# Altium schematic sheet VoltageHeaders.SchDoc
size 381 x 317 mm
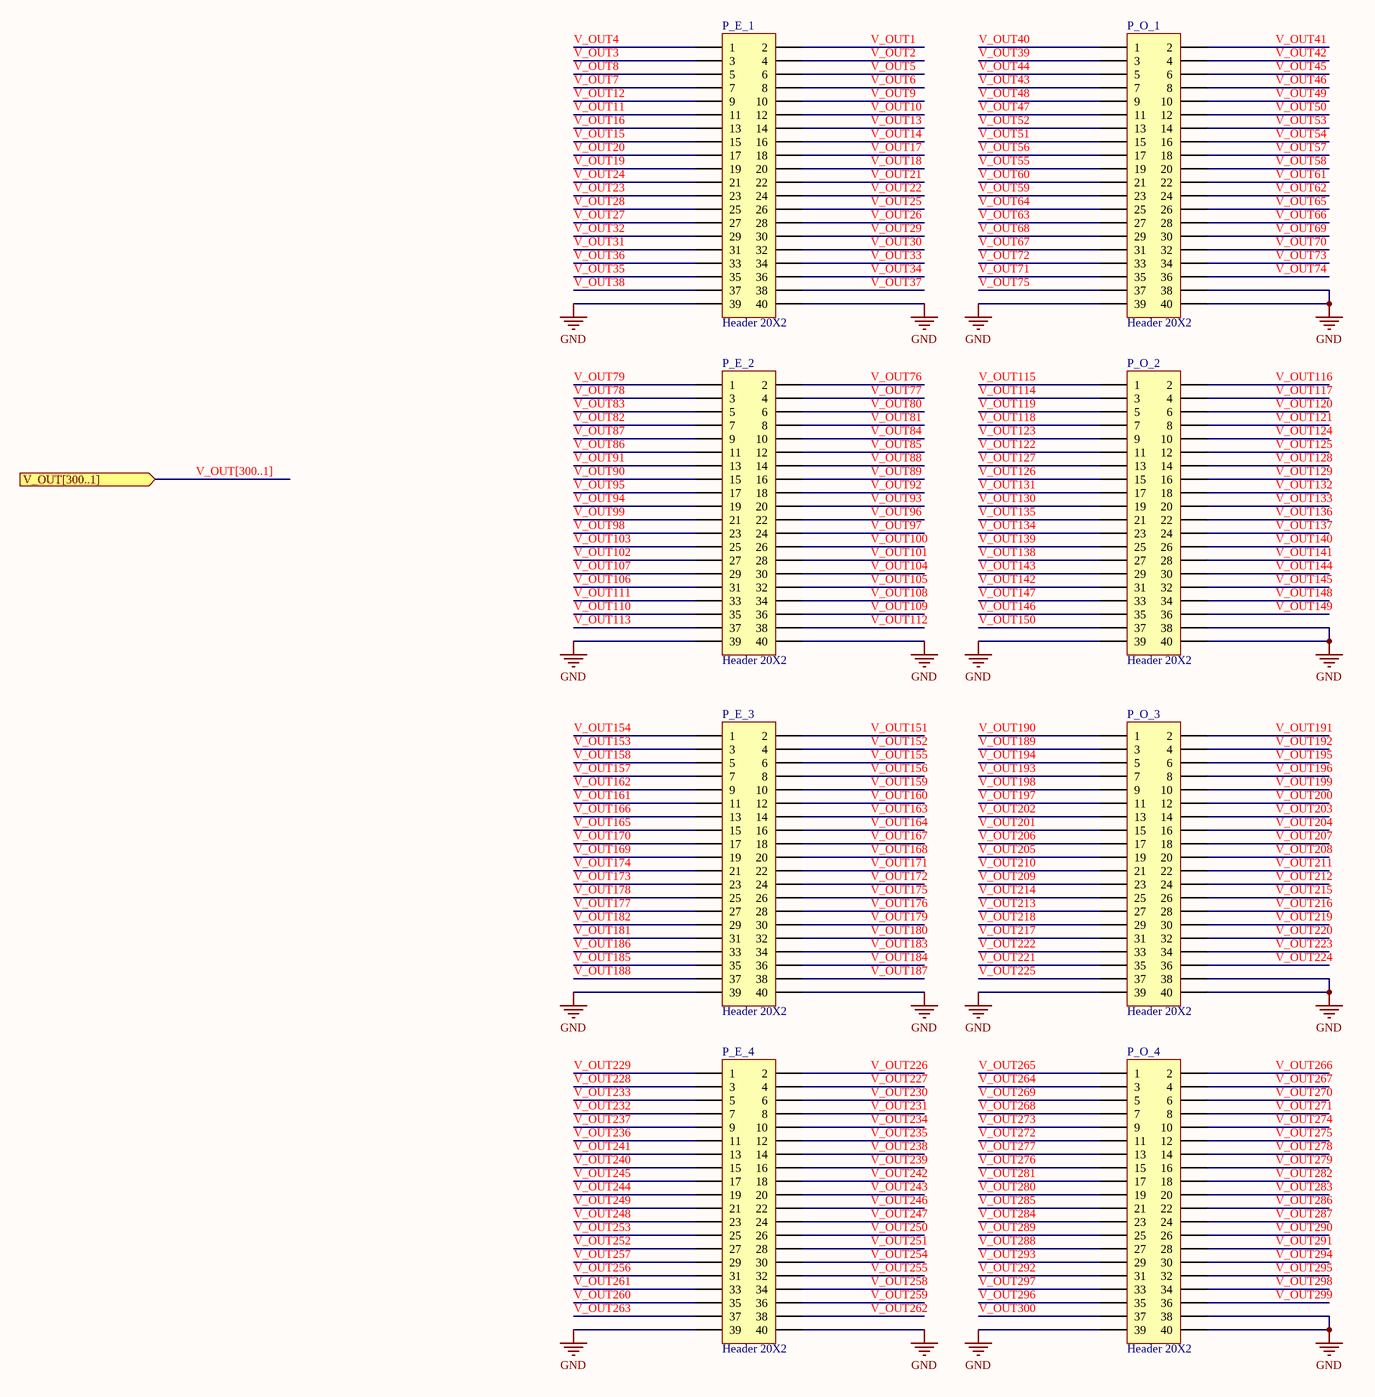
[diagram p0: VoltageHeaders.SchDoc]

## Parts
P_E_1  Header 20X2  [HDR2X20]
P_E_2  Header 20X2  [HDR2X20]
P_E_3  Header 20X2  [HDR2X20]
P_E_4  Header 20X2  [HDR2X20]
P_O_1  Header 20X2  [HDR2X20]
P_O_2  Header 20X2  [HDR2X20]
P_O_3  Header 20X2  [HDR2X20]
P_O_4  Header 20X2  [HDR2X20]

## Ports
V_OUT[300..1] (in)

## Nets
GND: P_E_1.39 P_E_1.40 P_E_2.39 P_E_2.40 P_E_3.39 P_E_3.40 P_E_4.39 P_E_4.40 P_O_1.38 P_O_1.39 P_O_1.40 P_O_2.38 P_O_2.39 P_O_2.40 P_O_3.38 P_O_3.39 P_O_3.40 P_O_4.38 P_O_4.39 P_O_4.40
V_OUT1: P_E_1.2
V_OUT2: P_E_1.4
V_OUT3: P_E_1.3
V_OUT4: P_E_1.1
V_OUT5: P_E_1.6
V_OUT6: P_E_1.8
V_OUT7: P_E_1.7
V_OUT8: P_E_1.5
V_OUT9: P_E_1.10
V_OUT10: P_E_1.12
V_OUT11: P_E_1.11
V_OUT12: P_E_1.9
V_OUT13: P_E_1.14
V_OUT14: P_E_1.16
V_OUT15: P_E_1.15
V_OUT16: P_E_1.13
V_OUT17: P_E_1.18
V_OUT18: P_E_1.20
V_OUT19: P_E_1.19
V_OUT20: P_E_1.17
V_OUT21: P_E_1.22
V_OUT22: P_E_1.24
V_OUT23: P_E_1.23
V_OUT24: P_E_1.21
V_OUT25: P_E_1.26
V_OUT26: P_E_1.28
V_OUT27: P_E_1.27
V_OUT28: P_E_1.25
V_OUT29: P_E_1.30
V_OUT30: P_E_1.32
V_OUT31: P_E_1.31
V_OUT32: P_E_1.29
V_OUT33: P_E_1.34
V_OUT34: P_E_1.36
V_OUT35: P_E_1.35
V_OUT36: P_E_1.33
V_OUT37: P_E_1.38
V_OUT38: P_E_1.37
V_OUT39: P_O_1.3
V_OUT40: P_O_1.1
V_OUT41: P_O_1.2
V_OUT42: P_O_1.4
V_OUT43: P_O_1.7
V_OUT44: P_O_1.5
V_OUT45: P_O_1.6
V_OUT46: P_O_1.8
V_OUT47: P_O_1.11
V_OUT48: P_O_1.9
V_OUT49: P_O_1.10
V_OUT50: P_O_1.12
V_OUT51: P_O_1.15
V_OUT52: P_O_1.13
V_OUT53: P_O_1.14
V_OUT54: P_O_1.16
V_OUT55: P_O_1.19
V_OUT56: P_O_1.17
V_OUT57: P_O_1.18
V_OUT58: P_O_1.20
V_OUT59: P_O_1.23
V_OUT60: P_O_1.21
V_OUT61: P_O_1.22
V_OUT62: P_O_1.24
V_OUT63: P_O_1.27
V_OUT64: P_O_1.25
V_OUT65: P_O_1.26
V_OUT66: P_O_1.28
V_OUT67: P_O_1.31
V_OUT68: P_O_1.29
V_OUT69: P_O_1.30
V_OUT70: P_O_1.32
V_OUT71: P_O_1.35
V_OUT72: P_O_1.33
V_OUT73: P_O_1.34
V_OUT74: P_O_1.36
V_OUT75: P_O_1.37
V_OUT76: P_E_2.2
V_OUT77: P_E_2.4
V_OUT78: P_E_2.3
V_OUT79: P_E_2.1
V_OUT80: P_E_2.6
V_OUT81: P_E_2.8
V_OUT82: P_E_2.7
V_OUT83: P_E_2.5
V_OUT84: P_E_2.10
V_OUT85: P_E_2.12
V_OUT86: P_E_2.11
V_OUT87: P_E_2.9
V_OUT88: P_E_2.14
V_OUT89: P_E_2.16
V_OUT90: P_E_2.15
V_OUT91: P_E_2.13
V_OUT92: P_E_2.18
V_OUT93: P_E_2.20
V_OUT94: P_E_2.19
V_OUT95: P_E_2.17
V_OUT96: P_E_2.22
V_OUT97: P_E_2.24
V_OUT98: P_E_2.23
V_OUT99: P_E_2.21
V_OUT100: P_E_2.26
V_OUT101: P_E_2.28
V_OUT102: P_E_2.27
V_OUT103: P_E_2.25
V_OUT104: P_E_2.30
V_OUT105: P_E_2.32
V_OUT106: P_E_2.31
V_OUT107: P_E_2.29
V_OUT108: P_E_2.34
V_OUT109: P_E_2.36
V_OUT110: P_E_2.35
V_OUT111: P_E_2.33
V_OUT112: P_E_2.38
V_OUT113: P_E_2.37
V_OUT114: P_O_2.3
V_OUT115: P_O_2.1
V_OUT116: P_O_2.2
V_OUT117: P_O_2.4
V_OUT118: P_O_2.7
V_OUT119: P_O_2.5
V_OUT120: P_O_2.6
V_OUT121: P_O_2.8
V_OUT122: P_O_2.11
V_OUT123: P_O_2.9
V_OUT124: P_O_2.10
V_OUT125: P_O_2.12
V_OUT126: P_O_2.15
V_OUT127: P_O_2.13
V_OUT128: P_O_2.14
V_OUT129: P_O_2.16
V_OUT130: P_O_2.19
V_OUT131: P_O_2.17
V_OUT132: P_O_2.18
V_OUT133: P_O_2.20
V_OUT134: P_O_2.23
V_OUT135: P_O_2.21
V_OUT136: P_O_2.22
V_OUT137: P_O_2.24
V_OUT138: P_O_2.27
V_OUT139: P_O_2.25
V_OUT140: P_O_2.26
V_OUT141: P_O_2.28
V_OUT142: P_O_2.31
V_OUT143: P_O_2.29
V_OUT144: P_O_2.30
V_OUT145: P_O_2.32
V_OUT146: P_O_2.35
V_OUT147: P_O_2.33
V_OUT148: P_O_2.34
V_OUT149: P_O_2.36
V_OUT150: P_O_2.37
V_OUT151: P_E_3.2
V_OUT152: P_E_3.4
V_OUT153: P_E_3.3
V_OUT154: P_E_3.1
V_OUT155: P_E_3.6
V_OUT156: P_E_3.8
V_OUT157: P_E_3.7
V_OUT158: P_E_3.5
V_OUT159: P_E_3.10
V_OUT160: P_E_3.12
V_OUT161: P_E_3.11
V_OUT162: P_E_3.9
V_OUT163: P_E_3.14
V_OUT164: P_E_3.16
V_OUT165: P_E_3.15
V_OUT166: P_E_3.13
V_OUT167: P_E_3.18
V_OUT168: P_E_3.20
V_OUT169: P_E_3.19
V_OUT170: P_E_3.17
V_OUT171: P_E_3.22
V_OUT172: P_E_3.24
V_OUT173: P_E_3.23
V_OUT174: P_E_3.21
V_OUT175: P_E_3.26
V_OUT176: P_E_3.28
V_OUT177: P_E_3.27
V_OUT178: P_E_3.25
V_OUT179: P_E_3.30
V_OUT180: P_E_3.32
V_OUT181: P_E_3.31
V_OUT182: P_E_3.29
V_OUT183: P_E_3.34
V_OUT184: P_E_3.36
V_OUT185: P_E_3.35
V_OUT186: P_E_3.33
V_OUT187: P_E_3.38
V_OUT188: P_E_3.37
V_OUT189: P_O_3.3
V_OUT190: P_O_3.1
V_OUT191: P_O_3.2
V_OUT192: P_O_3.4
V_OUT193: P_O_3.7
V_OUT194: P_O_3.5
V_OUT195: P_O_3.6
V_OUT196: P_O_3.8
V_OUT197: P_O_3.11
V_OUT198: P_O_3.9
V_OUT199: P_O_3.10
V_OUT200: P_O_3.12
V_OUT201: P_O_3.15
V_OUT202: P_O_3.13
V_OUT203: P_O_3.14
V_OUT204: P_O_3.16
V_OUT205: P_O_3.19
V_OUT206: P_O_3.17
V_OUT207: P_O_3.18
V_OUT208: P_O_3.20
V_OUT209: P_O_3.23
V_OUT210: P_O_3.21
V_OUT211: P_O_3.22
V_OUT212: P_O_3.24
V_OUT213: P_O_3.27
V_OUT214: P_O_3.25
V_OUT215: P_O_3.26
V_OUT216: P_O_3.28
V_OUT217: P_O_3.31
V_OUT218: P_O_3.29
V_OUT219: P_O_3.30
V_OUT220: P_O_3.32
V_OUT221: P_O_3.35
V_OUT222: P_O_3.33
V_OUT223: P_O_3.34
V_OUT224: P_O_3.36
V_OUT225: P_O_3.37
V_OUT226: P_E_4.2
V_OUT227: P_E_4.4
V_OUT228: P_E_4.3
V_OUT229: P_E_4.1
V_OUT230: P_E_4.6
V_OUT231: P_E_4.8
V_OUT232: P_E_4.7
V_OUT233: P_E_4.5
V_OUT234: P_E_4.10
V_OUT235: P_E_4.12
V_OUT236: P_E_4.11
V_OUT237: P_E_4.9
V_OUT238: P_E_4.14
V_OUT239: P_E_4.16
V_OUT240: P_E_4.15
V_OUT241: P_E_4.13
V_OUT242: P_E_4.18
V_OUT243: P_E_4.20
V_OUT244: P_E_4.19
V_OUT245: P_E_4.17
V_OUT246: P_E_4.22
V_OUT247: P_E_4.24
V_OUT248: P_E_4.23
V_OUT249: P_E_4.21
V_OUT250: P_E_4.26
V_OUT251: P_E_4.28
V_OUT252: P_E_4.27
V_OUT253: P_E_4.25
V_OUT254: P_E_4.30
V_OUT255: P_E_4.32
V_OUT256: P_E_4.31
V_OUT257: P_E_4.29
V_OUT258: P_E_4.34
V_OUT259: P_E_4.36
V_OUT260: P_E_4.35
V_OUT261: P_E_4.33
V_OUT262: P_E_4.38
V_OUT263: P_E_4.37
V_OUT264: P_O_4.3
V_OUT265: P_O_4.1
V_OUT266: P_O_4.2
V_OUT267: P_O_4.4
V_OUT268: P_O_4.7
V_OUT269: P_O_4.5
V_OUT270: P_O_4.6
V_OUT271: P_O_4.8
V_OUT272: P_O_4.11
V_OUT273: P_O_4.9
V_OUT274: P_O_4.10
V_OUT275: P_O_4.12
V_OUT276: P_O_4.15
V_OUT277: P_O_4.13
V_OUT278: P_O_4.14
V_OUT279: P_O_4.16
V_OUT280: P_O_4.19
V_OUT281: P_O_4.17
V_OUT282: P_O_4.18
V_OUT283: P_O_4.20
V_OUT284: P_O_4.23
V_OUT285: P_O_4.21
V_OUT286: P_O_4.22
V_OUT287: P_O_4.24
V_OUT288: P_O_4.27
V_OUT289: P_O_4.25
V_OUT290: P_O_4.26
V_OUT291: P_O_4.28
V_OUT292: P_O_4.31
V_OUT293: P_O_4.29
V_OUT294: P_O_4.30
V_OUT295: P_O_4.32
V_OUT296: P_O_4.35
V_OUT297: P_O_4.33
V_OUT298: P_O_4.34
V_OUT299: P_O_4.36
V_OUT300: P_O_4.37

## Buses and harness runs
bus V_OUT[300..1] = port V_OUT[300..1]

## Library data of the parts
P_E_1-P_E_4 P_O_1-P_O_4 = Header 20X2: Headers & Wire Housings 2X20 POS VERT TIN; Mfr: TE Connectivity / AMP; Mfr Part No: 2-826942-0; Value: 40; Package: DIN; Price: 2.5; Stockiest: MOUSER; Stockiest Part No: 571-2-826942-0